# Altium schematic sheet TopLevel.SchDoc: =DocumentName
size A3; Organization: ORGANIZATION; Address1: R. Aprígio Veloso, 882, Universitário; Address2: Campina Grande - PB; Address3: 58429-900; Revision: -; SheetNumber: 3; SheetTotal: 3; ENG_DATE: --/--/--; DSN_DATE: --/--/--; CHK_DATE: --/--/--; SCH_SCALE: 1:1
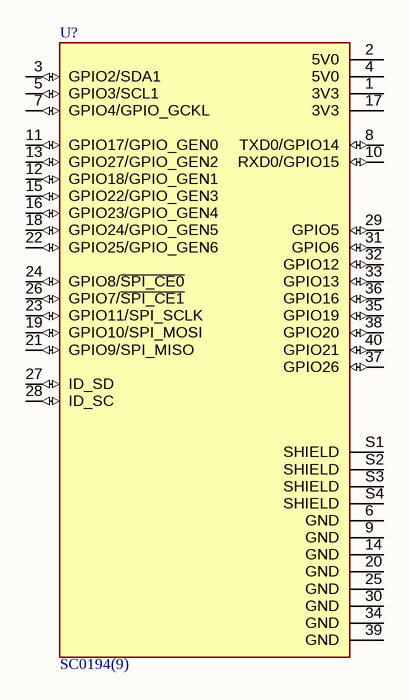
[diagram p0: TopLevel.SchDoc]

## Parts
U?  SC0194(9)  [MODULE_SC0194(9)]

## Nets

Not connected (* = marked no-connect by the designer): U? 1(3V3) 2(5V0) 3(GPIO2/SDA1) 4(5V0) 5(GPIO3/SCL1) 6(GND) 7(GPIO4/GPIO_GCKL) 8(TXD0/GPIO14) 9(GND) 10(RXD0/GPIO15) 11(GPIO17/GPIO_GEN0) 12(GPIO18/GPIO_GEN1) 13(GPIO27/GPIO_GEN2) 14(GND) 15(GPIO22/GPIO_GEN3) 16(GPIO23/GPIO_GEN4) 17(3V3) 18(GPIO24/GPIO_GEN5) 19(GPIO10/SPI_MOSI) 20(GND) 21(GPIO9/SPI_MISO) 22(GPIO25/GPIO_GEN6) 23(GPIO11/SPI_SCLK) 24(GPIO8/~{SPI_CE0}) 25(GND) 26(GPIO7/~{SPI_CE1}) 27(ID_SD) 28(ID_SC) 29(GPIO5) 30(GND) 31(GPIO6) 32(GPIO12) 33(GPIO13) 34(GND) 35(GPIO19) 36(GPIO16) 37(GPIO26) 38(GPIO20) 39(GND) 40(GPIO21) S1(SHIELD) S2(SHIELD) S3(SHIELD) S4(SHIELD)

## Notes on the sheet
- REVISION
- DESCRIPTION
- DATE
- APPROVED
- ADDRESS
- PROJECT
- VERSION
- TITLE
- A3
- SIZE
- SCALE
- DOCUMENT NAME:
- DOCUMENT REVISION:
- OF
- SHEET:
- PROJECT REVISION:

## Library data of the parts
U? = SC0194(9): The Raspberry Pi 4 Model B SC0194(9) single board computer features a Broadcom BCM2711 ARM Cortex-A72 quad-core processor operating at 1.5GHz, making it a powerful choice for embedded computing applications. Equipped with 4GB of RAM and a variety of conne; SnapEDA_Link: https://www.snapeda.com/parts/SC0194(9)/Raspberry+Pi/view-part/?ref=snap; Package: None; Value: *; MF: Raspberry Pi; MP: SC0194(9); Check_prices: https://www.snapeda.com/parts/SC0194(9)/Raspberry+Pi/view-part/?ref=eda